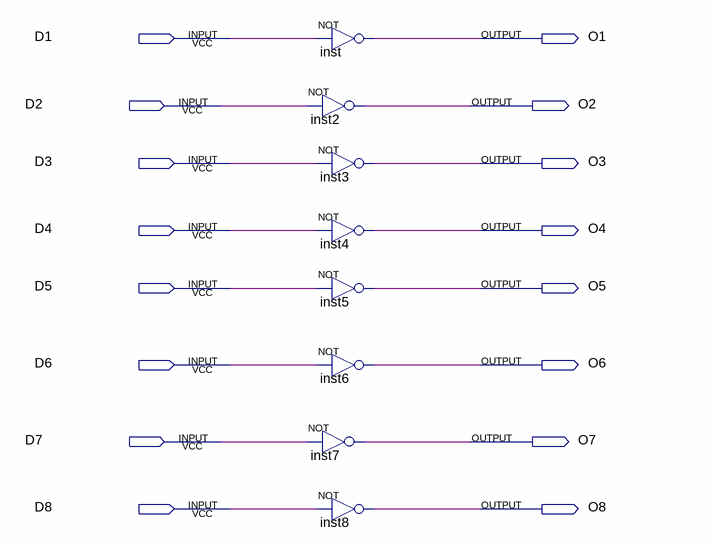
[diagram p0: schematic sheet]
// Quartus schematic NOT08.bdf as structural Verilog: 8 symbols, 16 pins
module NOT08 (
  input  D1,
  input  D2,
  input  D3,
  input  D4,
  input  D5,
  input  D6,
  input  D7,
  input  D8,
  output O1,
  output O2,
  output O3,
  output O4,
  output O5,
  output O6,
  output O7,
  output O8
);

  not inst (O1, D1);
  not inst2 (O2, D2);
  not inst3 (O3, D3);
  not inst4 (O4, D4);
  not inst5 (O5, D5);
  not inst6 (O6, D6);
  not inst7 (O7, D7);
  not inst8 (O8, D8);
endmodule
